# EAGLE design led (EAGLE 7.4.0)
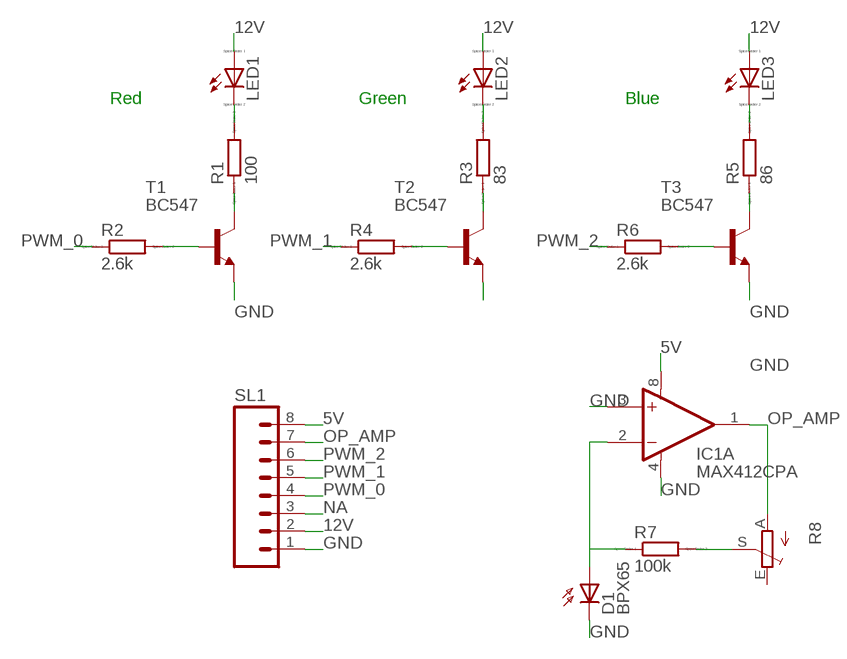
[diagram p0: schematic, sheet 1]

## Parts
D1  BPX65  [BPX65]
IC1  MAX412CPA  [DIL08]
LED1  LED_ELD260  [LED_LD260]
LED2  LED_ELD260  [LED_LD260]
LED3  LED_ELD260  [LED_LD260]
R1  100  R0204/7  [0204/7]
R2  2.6k  R0204/7  [0204/7]
R3  83  R0204/7  [0204/7]
R4  2.6k  R0204/7  [0204/7]
R5  86  R0204/7  [0204/7]
R6  2.6k  R0204/7  [0204/7]
R7  100k  R0204/7  [0204/7]
R8  TRIM_EU-B90P  [SP19L]
SL1  M08  [08P]
T1  BC547  [TO92]
T2  BC547  [TO92]
T3  BC547  [TO92]

## Nets
5V: IC1.8(A:V+) SL1.8
12V: LED1.A LED2.A LED3.A SL1.2
GND: D1.K(C) IC1.3(A:+IN) IC1.4(A:V-) SL1.1 T1.1(E) T2.1(E) T3.1(E)
N$1: R4.2 T2.2(B)
N$2: LED1.K(C) R1.2
N$3: R2.2 T1.2(B)
N$4: R1.1 T1.3(C)
N$5: LED2.K(C) R3.2
N$6: R3.1 T2.3(C)
N$7: R6.2 T3.2(B)
N$8: LED3.K(C) R5.2
N$9: R5.1 T3.3(C)
N$10: D1.A IC1.2(A:-IN) R7.1
N$12: R7.2 R8.S
NA: SL1.3
OP_AMP: IC1.1(A:OUT) R8.A SL1.7
PWM_0: R2.1 SL1.4
PWM_1: R4.1 SL1.5
PWM_2: R6.1 SL1.6
Unconnected: IC1.5(B:+IN) IC1.6(B:-IN) IC1.7(B:OUT) R8.E

## Notes on the sheet
- Red | Green | Blue

## Library data of the parts
D1 = opto-trans-siemens:BPX65: PHOTO DIODE; MPN: BPX65.; OC_FARNELL: 327451; OC_NEWARK: 06WX2764
IC1 = maxim:MAX412CPA: OP AMP; MPN: MAX412CPA; OC_FARNELL: unknown; OC_NEWARK: 99K3347
LED1-LED3 = eagle-ltspice:LED_E: LED Source: http://www.osram.convergy.de Source: www.luxeon.com Source: www.kingbright.com; SPICEMODEL: NONE; SPICEPREFIX: D; SPICETYPE: diode
R1-R7 = eagle-ltspice:R: RESISTOR, European symbol; SPICEMODEL: NONE; SPICEPREFIX: R
R8 = pot:TRIM_EU-: POTENTIOMETER
SL1 = con-amp-quick:M08: AMP QUICK CONNECTOR; OC_FARNELL: unknown; OC_NEWARK: unknown
T1-T3 = transistor:BC547: NPN TRANSISTOR

## Board
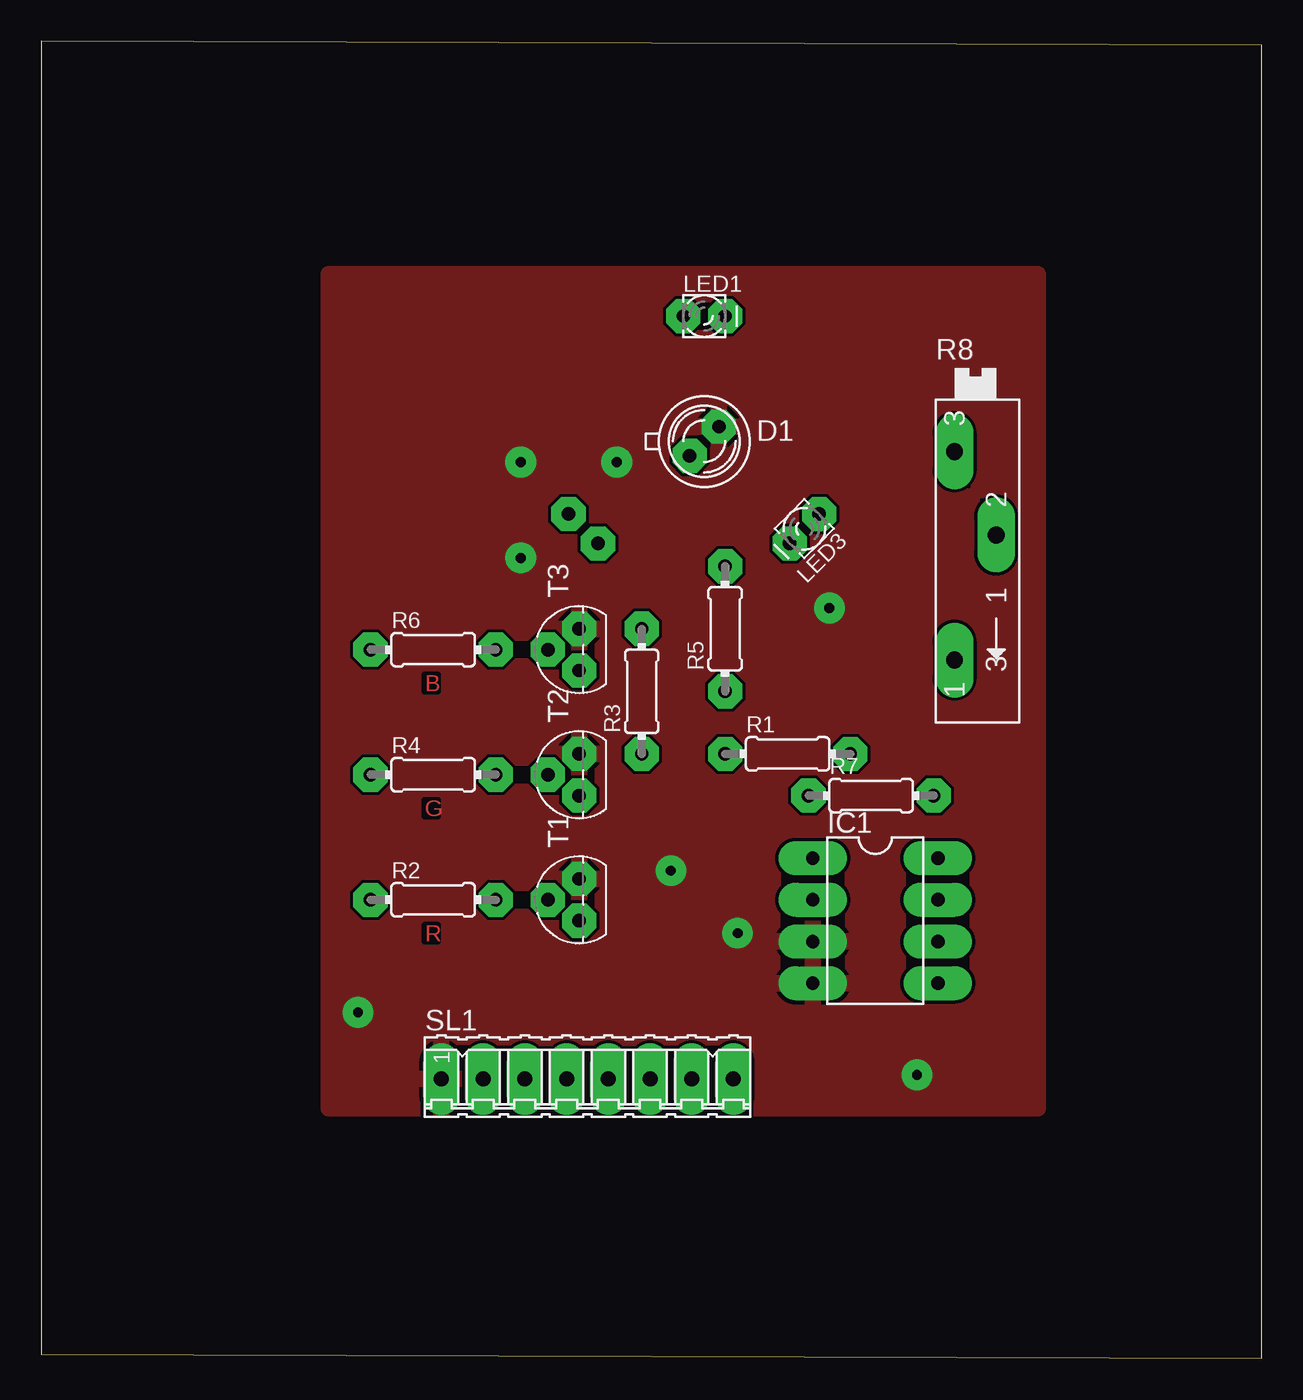
[diagram p1: board, top side]
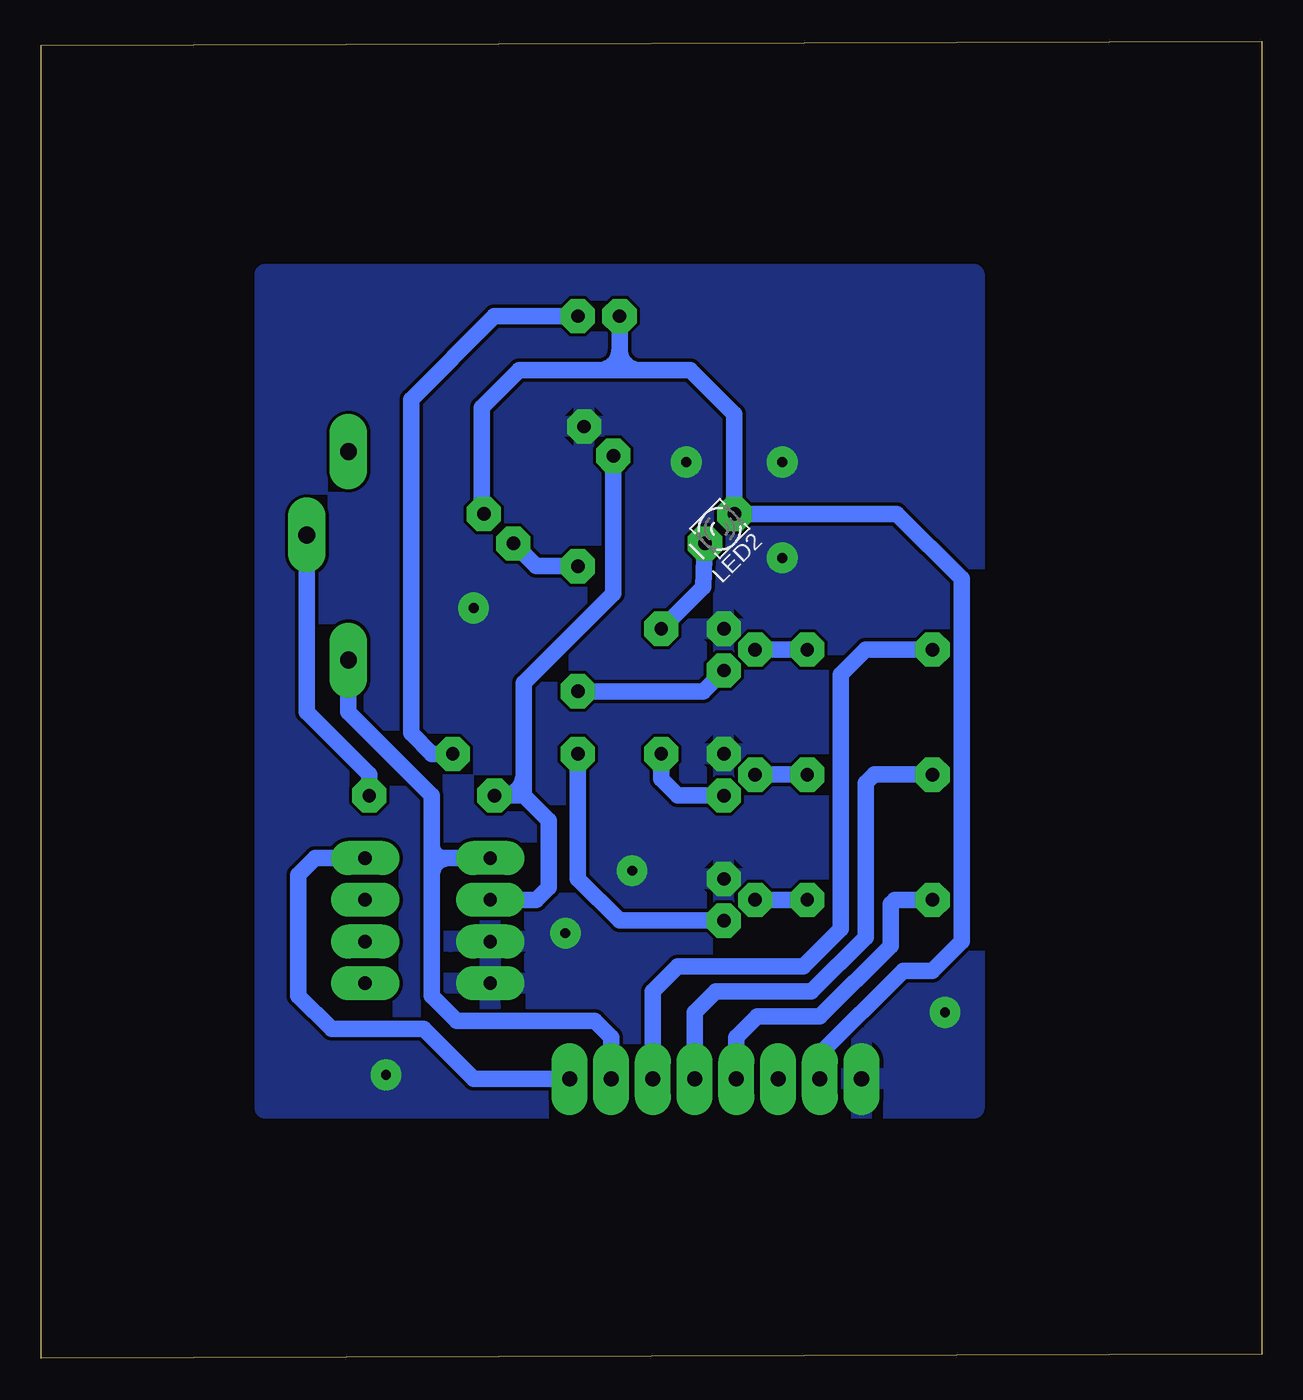
[diagram p2: board, bottom side, seen from below]

Size 74.35 x 80.25 mm. Coordinates in mm from the lower left corner, seen from the top.
Outline: 0,0.25 74.35,0 74.35,80 0,80.25 0,0.25
Copper layers (1*16): Top 0.035mm / dielectric 1.5mm / Bottom 0.035mm
Design rules "default *": minimum track width 10mil, minimum drill 24mil, track to track 8mil, track to pad 8mil, pad to pad 8mil, via to via 8mil, smd to smd 8mil, copper to edge 40mil, drill to drill 8mil, minimum pad ring 25mil, minimum via ring 25mil, stop-mask expansion 4mil, vias tented up to drill 0mil, thermal gap 10mil

### Footprints (pad centres in the part's own frame; a part is rotated, then mirrored left to right if it is on the bottom)
BPX65 = drill 0.813 octagon: A -0.889,-0.889; K 0.889,0.889
DIL08 = drill 0.813 long: 1 -3.81,-3.81; 2 -1.27,-3.81; 3 1.27,-3.81; 4 3.81,-3.81; 5 3.81,3.81; 6 1.27,3.81; 7 -1.27,3.81; 8 -3.81,3.81
LED_LD260 = drill 0.813 octagon: A -1.27,0; K 1.27,0
0204/7 = drill 0.813 octagon: 1 -3.81,0; 2 3.81,0
SP19L = drill 1.016 long: A 5.715,-1.27; E -6.985,-1.27; S -1.905,1.27
08P = drill 0.914 long: 1 -8.89,0; 2 -6.35,0; 3 -3.81,0; 4 -1.27,0; 5 1.27,0; 6 3.81,0; 7 6.35,0; 8 8.89,0
TO92 = drill 0.813 octagon: 1 1.27,0; 2 0,1.905; 3 -1.27,0

### Placement (x,y rotation side)
D1  40.39,55.88 0 top
IC1  50.8,26.67 270 top
LED1  40.39,63.5 0 top
LED2  33.02,50.55 225 bottom
LED3  46.48,50.55 225 top
R1  45.47,36.83 0 top
R2  23.88,27.94 0 top
R3  36.58,40.64 90 top
R4  23.88,35.56 0 top
R5  41.66,44.45 90 top
R6  23.88,43.18 0 top
R7  50.55,34.29 0 top
R8  56.9,48.26 270 top
SL1  33.27,17.02 0 top
T1  32.77,27.94 90 top
T2  32.77,35.56 90 top
T3  32.77,43.18 90 top

### Tracks (layer width: path | path; a pad name or v marks a point on that pad's centre or on a via)
5V
  Bottom 1.016: SL1.8 48.01,17.02 51.05,20.07 56.64,20.07 58.67,22.1 58.67,29.46 57.66,30.48 IC1.8
12V
  Bottom 1.016: SL1.2 26.92,18.54 21.84,23.62 20.07,23.62 18.29,25.4 18.29,47.5 22.23,51.44 LED2.A 32.12,57.52 34.8,60.2 37.85,60.2 | 37.85,60.2 39.37,60.2 | 39.37,60.2 40.39,60.2 | 40.39,60.2 45.21,60.2 47.5,57.91 47.5,51.56 LED3.A | LED1.A 39.12,61.47 | 39.12,61.47 39.12,60.45 39.37,60.2 | 39.12,61.47 arc90 40.39,60.2 | 39.12,61.47 arc-90 37.85,60.2
GND  (via drill 0.6, 0.6 pad 1.78)
  other vias: 29.21,54.61 53.34,17.27 48.01,45.72 19.3,21.08 42.42,25.91 38.35,29.72 35.05,54.61 29.21,48.77
  pour Top: 17.53,15.24 60.71,15.24 60.71,66.04 17.53,66.04
  pour Bottom: 17.53,15.24 60.71,15.24 60.71,66.04 17.53,66.04
N$1
  Bottom 1.016: T2.2 R4.2
N$2
  Bottom 1.016: LED1.K 46.74,63.5 51.82,58.42 51.82,38.1 50.55,36.83 R1.2
N$3
  Bottom 1.016: R2.2 T1.2
N$4
  Bottom 1.016: T1.3 39.12,26.67 41.66,29.21 R1.1
N$5
  Bottom 1.016: LED2.K 34.04,46.99 R3.2
N$6
  Bottom 1.016: R3.1 36.58,35.31 35.56,34.29 T2.3
N$7
  Bottom 1.016: T3.2 R6.2
N$8
  Bottom 1.016: R5.2 44.2,48.26 LED3.K
N$9
  Bottom 1.016: R5.1 34.04,40.64 T3.3
N$10
  Bottom 1.016: R7.1 46.48,34.29 46.23,34.29 | 46.23,34.29 45.21,34.29 | 45.21,34.29 44.96,34.29 43.43,32.77 43.43,28.7 44.2,27.94 IC1.2 | D1.A 39.5,46.61 44.96,41.15 44.96,35.56 | 44.96,35.56 44.96,34.54 45.21,34.29 | 44.96,35.56 arc90 46.23,34.29
N$12
  Bottom 1.016: R7.2 54.36,35.56 58.17,39.37 R8.S
OP_AMP
  Bottom 1.016: SL1.7 39.62,19.56 40.64,20.57 49.02,20.57 50.55,22.1 50.55,29.46 | 50.55,29.46 50.55,30.48 | 50.55,30.48 50.55,31.24 | 50.55,30.48 49.78,30.48 | 49.78,30.48 49.53,30.48 | 49.53,30.48 IC1.1 | R8.A 55.63,39.37 50.55,34.29 50.55,31.75 50.55,31.24 | 49.53,30.48 arc-90 50.55,29.46 | 49.78,30.48 arc90 50.55,31.24
PWM_0
  Bottom 1.016: R2.1 22.35,27.94 22.61,27.69 22.61,25.15 26.92,20.83 30.73,20.83 32,19.56 SL1.4
PWM_1
  Bottom 1.016: R4.1 23.62,35.56 24.13,35.05 24.13,25.65 27.43,22.35 33.27,22.35 34.54,21.08 SL1.5
PWM_2
  Bottom 1.016: R6.1 24.13,43.18 25.65,41.66 25.65,26.16 27.94,23.88 35.56,23.88 37.08,22.35 SL1.6

### Text on the board
Top: B | G | R